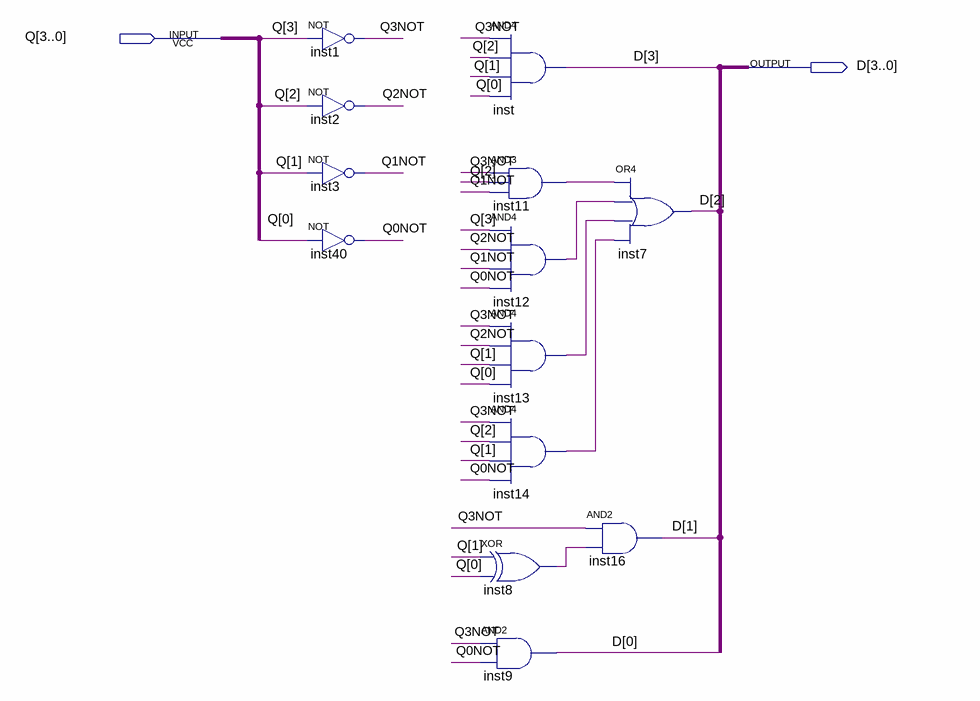
[diagram p0: schematic sheet]
// Quartus schematic TTKT.bdf as structural Verilog: 13 symbols, 2 pins
module TTKT (
  input  [3:0] Q,
  output [3:0] D
);

  wire inst8_out, inst11_out, inst12_out, inst13_out, inst14_out, Q0NOT, Q1NOT, Q2NOT, Q3NOT;

  not inst1 (Q3NOT, Q[3]);
  not inst2 (Q2NOT, Q[2]);
  not inst3 (Q1NOT, Q[1]);
  not inst40 (Q0NOT, Q[0]);
  and inst (D[3], Q3NOT, Q[2], Q[1], Q[0]);
  and inst11 (inst11_out, Q3NOT, Q[2], Q1NOT);
  and inst12 (inst12_out, Q[3], Q2NOT, Q1NOT, Q0NOT);
  and inst13 (inst13_out, Q3NOT, Q2NOT, Q[1], Q[0]);
  and inst14 (inst14_out, Q3NOT, Q[2], Q[1], Q0NOT);
  xor inst8 (inst8_out, Q[1], Q[0]);
  and inst9 (D[0], Q3NOT, Q0NOT);
  and inst16 (D[1], Q3NOT, inst8_out);
  or inst7 (D[2], inst11_out, inst12_out, inst13_out, inst14_out);
endmodule
